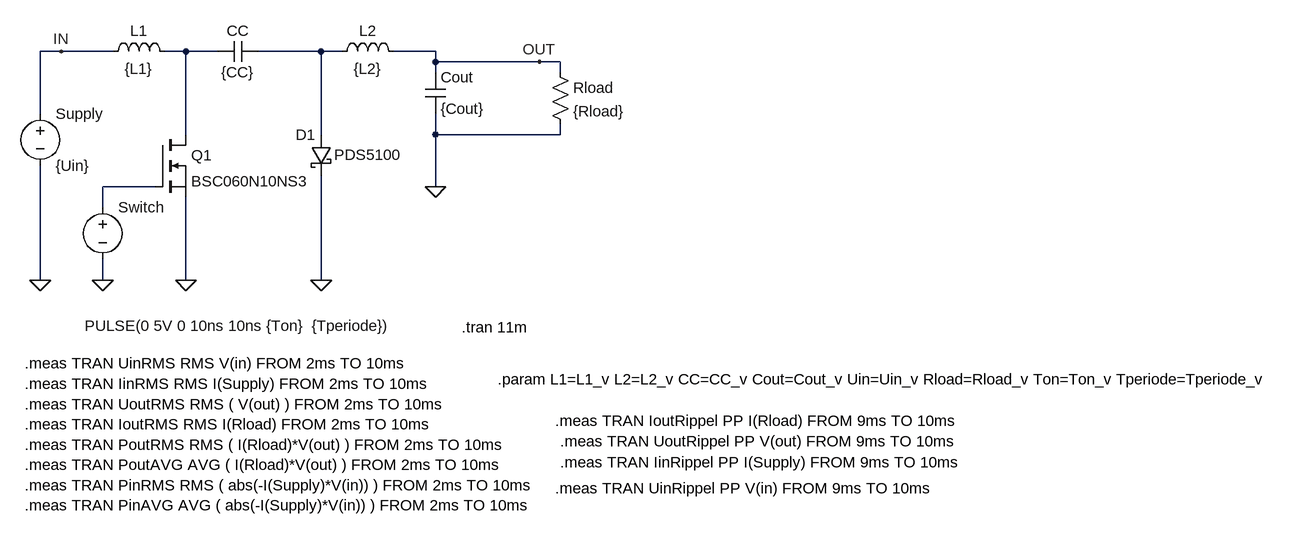
[diagram p0: schematic CukVariable.asc]
CukVariable.asc, the LTspice schematic file:
Version 4
SHEET 1 3080 1464
WIRE 1024 352 992 352
WIRE 1104 352 1024 352
WIRE 1216 352 1184 352
WIRE 1264 352 1216 352
WIRE 1424 352 1328 352
WIRE 1456 352 1424 352
WIRE 1600 352 1536 352
WIRE 1600 368 1600 352
WIRE 1760 368 1600 368
WIRE 1792 368 1760 368
WIRE 1600 384 1600 368
WIRE 1792 384 1792 368
WIRE 992 448 992 352
WIRE 1216 480 1216 352
WIRE 1424 480 1424 352
WIRE 1600 480 1600 448
WIRE 1792 480 1792 464
WIRE 1792 480 1600 480
WIRE 1168 560 1088 560
WIRE 1600 560 1600 480
WIRE 1088 592 1088 560
WIRE 992 704 992 528
WIRE 1088 704 1088 672
WIRE 1216 704 1216 576
WIRE 1424 704 1424 544
FLAG 1760 368 OUT
FLAG 1024 352 IN
FLAG 1216 704 0
FLAG 992 704 0
FLAG 1088 704 0
FLAG 1424 704 0
FLAG 1600 560 0
SYMBOL nmos 1168 480 R0
SYMATTR InstName Q1
SYMATTR Value BSC060N10NS3
SYMBOL ind 1088 368 R270
WINDOW 0 32 56 VTop 2
WINDOW 3 5 56 VBottom 2
SYMATTR InstName L1
SYMATTR Value {L1}
SYMATTR SpiceLine Ipk=16.7 Rser=0.0187 Rpar=3108.6 Cpar=0
SYMBOL schottky 1440 480 M0
WINDOW 3 -107 31 Left 2
SYMATTR Value PDS5100
SYMATTR InstName D1
SYMATTR Description Diode
SYMATTR Type diode
SYMBOL cap 1584 384 R0
SYMATTR SpiceLine Rser=0.004
SYMATTR Value {Cout}
SYMATTR InstName Cout
SYMBOL res 1776 368 R0
SYMATTR InstName Rload
SYMATTR Value {Rload}
SYMBOL voltage 992 432 R0
WINDOW 123 0 0 Left 2
WINDOW 39 0 0 Left 2
SYMATTR InstName Supply
SYMATTR Value {Uin}
SYMBOL voltage 1088 576 R0
WINDOW 123 0 0 Left 2
WINDOW 39 0 0 Left 2
WINDOW 3 -28 198 Left 2
SYMATTR Value PULSE(0 5V 0 10ns 10ns {Ton}  {Tperiode})
SYMATTR InstName Switch
SYMBOL ind 1440 368 R270
WINDOW 0 32 56 VTop 2
WINDOW 3 5 56 VBottom 2
SYMATTR InstName L2
SYMATTR Value {L2}
SYMATTR SpiceLine Ipk=16.7 Rser=0.0187 Rpar=3108.6 Cpar=0 mfg="Coilcraft" pn="XAL1510-333"
SYMBOL cap 1328 336 R90
WINDOW 3 32 32 VTop 2
WINDOW 0 0 32 VBottom 2
SYMATTR Value {CC}
SYMATTR InstName CC
SYMATTR SpiceLine Rser=0.004
TEXT 1640 776 Left 2 !.tran 11m
TEXT 968 832 Left 2 !.meas TRAN UinRMS RMS V(in) FROM 2ms TO 10ms\n.meas TRAN IinRMS RMS I(Supply) FROM 2ms TO 10ms\n.meas TRAN UoutRMS RMS ( V(out) ) FROM 2ms TO 10ms\n.meas TRAN IoutRMS RMS I(Rload) FROM 2ms TO 10ms\n.meas TRAN PoutRMS RMS ( I(Rload)*V(out) ) FROM 2ms TO 10ms\n.meas TRAN PoutAVG AVG ( I(Rload)*V(out) ) FROM 2ms TO 10ms\n.meas TRAN PinRMS RMS ( abs(-I(Supply)*V(in)) ) FROM 2ms TO 10ms\n.meas TRAN PinAVG AVG ( abs(-I(Supply)*V(in)) ) FROM 2ms TO 10ms
TEXT 1784 920 Left 2 !.meas TRAN IoutRippel PP I(Rload) FROM 9ms TO 10ms
TEXT 1792 952 Left 2 !.meas TRAN UoutRippel PP V(out) FROM 9ms TO 10ms
TEXT 1784 1024 Left 2 !.meas TRAN UinRippel PP V(in) FROM 9ms TO 10ms
TEXT 1792 984 Left 2 !.meas TRAN IinRippel PP I(Supply) FROM 9ms TO 10ms
TEXT 1696 856 Left 2 !.param L1=L1_v L2=L2_v CC=CC_v Cout=Cout_v Uin=Uin_v Rload=Rload_v Ton=Ton_v Tperiode=Tperiode_v

The netlist it stands for:
* CukVariable.asc
M§Q1 N001 N003 0 0 BSC060N10NS3
L1 IN N001 {L1} Ipk=16.7 Rser=0.0187 Rpar=3108.6 Cpar=0
D1 N002 0 PDS5100
Cout OUT 0 {Cout} Rser=0.004
Rload OUT 0 {Rload}
V§Supply IN 0 {Uin}
V§Switch N003 0 PULSE(0 5V 0 10ns 10ns {Ton}  {Tperiode})
L2 N002 OUT {L2} Ipk=16.7 Rser=0.0187 Rpar=3108.6 Cpar=0 mfg="Coilcraft" pn="XAL1510-333"
CC N002 N001 {CC} Rser=0.004
.model D D
.lib standard.dio
.model NMOS NMOS
.model PMOS PMOS
.lib standard.mos
.tran 11m
.meas TRAN UinRMS RMS V(in) FROM 2ms TO 10ms
.meas TRAN IinRMS RMS I(Supply) FROM 2ms TO 10ms
.meas TRAN UoutRMS RMS ( V(out) ) FROM 2ms TO 10ms
.meas TRAN IoutRMS RMS I(Rload) FROM 2ms TO 10ms
.meas TRAN PoutRMS RMS ( I(Rload)*V(out) ) FROM 2ms TO 10ms
.meas TRAN PoutAVG AVG ( I(Rload)*V(out) ) FROM 2ms TO 10ms
.meas TRAN PinRMS RMS ( abs(-I(Supply)*V(in)) ) FROM 2ms TO 10ms
.meas TRAN PinAVG AVG ( abs(-I(Supply)*V(in)) ) FROM 2ms TO 10ms
.meas TRAN IoutRippel PP I(Rload) FROM 9ms TO 10ms
.meas TRAN UoutRippel PP V(out) FROM 9ms TO 10ms
.meas TRAN UinRippel PP V(in) FROM 9ms TO 10ms
.meas TRAN IinRippel PP I(Supply) FROM 9ms TO 10ms
.param L1=L1_v L2=L2_v CC=CC_v Cout=Cout_v Uin=Uin_v Rload=Rload_v Ton=Ton_v Tperiode=Tperiode_v
.backanno
.end